# EasyEDA Pro project ProPrj_picoballoon-tracker-v2_2025-12-21.epro, schematic Schematic3
Board Name: Board3; Create Date: 2025-09-18; Page Name: P1; Project Name: picoballoon-tracker-v2; Schematic Name: Schematic3; Update Date: 2025-09-19; Company: EasyEDA.com; Page Size: A4; Version: V1.0
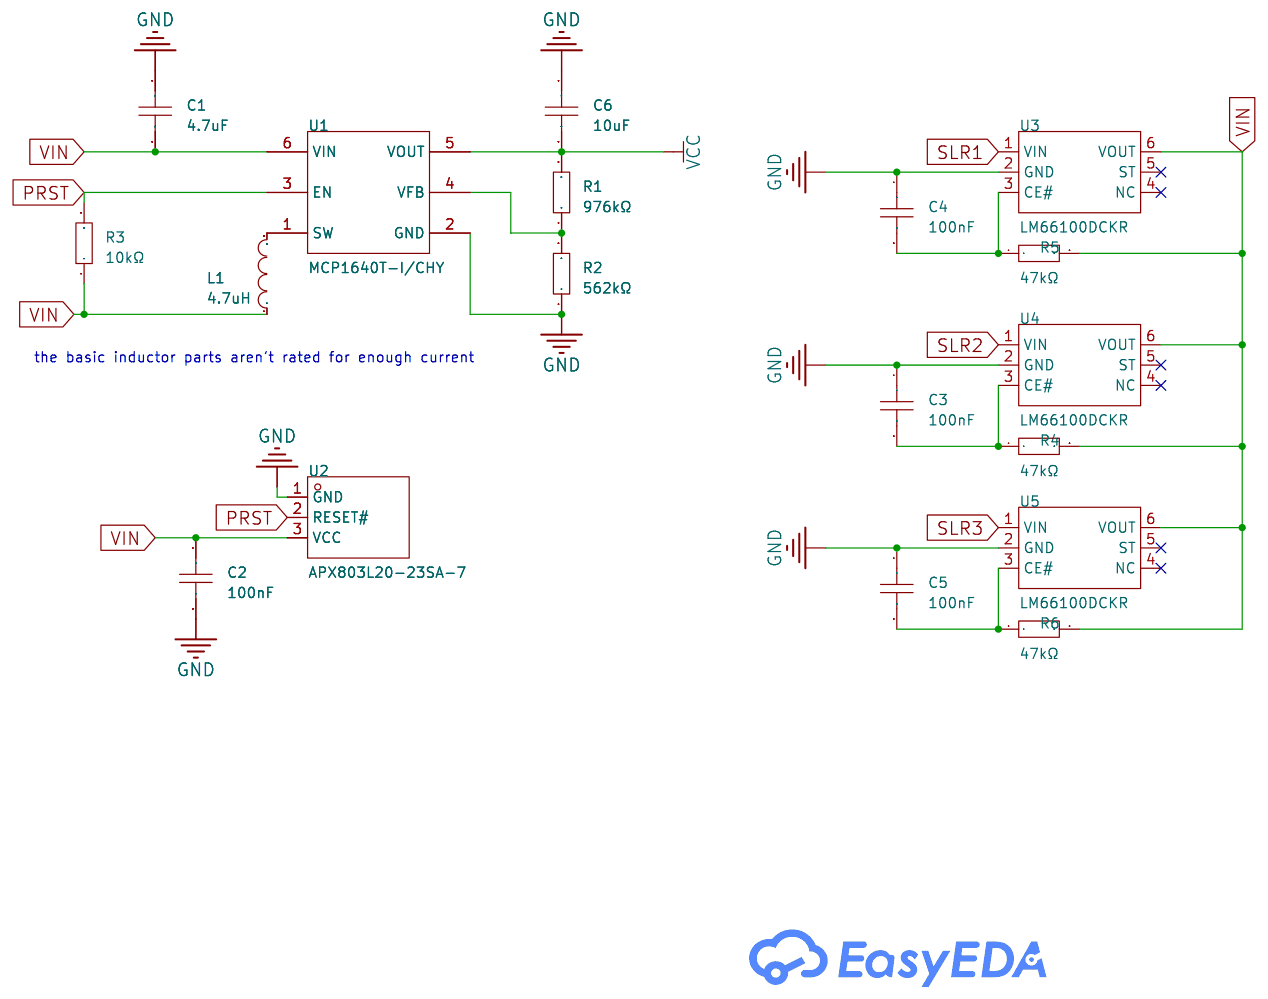
[diagram p2: schematic sheet]

## Parts
C1  4.7uF  [C0402]
C2  100nF  [C0402]
C3  100nF  [C0402]
C4  100nF  [C0402]
C5  100nF  [C0402]
C6  10uF  [C0402]
L1  4.7uH  [L0805]
R1  976kΩ  [R0402]
R2  562kΩ  [R0402]
R3  10kΩ  [R0402]
R4  47kΩ  [R0402]
R5  47kΩ  [R0402]
R6  47kΩ  [R0402]
U1  MCP1640T-I/CHY  [SOT-23-6_L2.9-W1.6-P0.95-LS2.8-BR]
U2  APX803L20-23SA-7  [SOT-23-3_L2.9-W1.3-P1.90-LS2.4-BR]
U3  LM66100DCKR  [SC-70-6_L2.0-W1.3-P0.65-LS2.1-BL]
U4  LM66100DCKR  [SC-70-6_L2.0-W1.3-P0.65-LS2.1-BL]
U5  LM66100DCKR  [SC-70-6_L2.0-W1.3-P0.65-LS2.1-BL]

## Library data of the parts
C1 = CL05A475MP5NRNC: Capacitance:4.7uF Tolerance:±20% Tolerance:±20% Voltage Rating:10V Temperature Coefficient:X5R; LCSC Part Name: 4.7uF ±20% 10V; Supplier Part: C23733; Manufacturer: SAMSUNG(三星); Supplier Footprint: 0402; JLCPCB Part Class: Basic Part; Datasheet: https://item.szlcsc.com/datasheet/CL05A475MP5NRNC/24469.html; Supplier: LCSC; Tolerance: ±20%; Voltage Rating: 10V; Temperature Coefficient: X5R
C2-C5 = CL05B104KO5NNNC: Capacitance:100nF Tolerance:±10% Tolerance:±10% Voltage Rating:16V Temperature Coefficient:X7R; LCSC Part Name: 100nF ±10% 16V; Supplier Part: C1525; Manufacturer: SAMSUNG(三星); Supplier Footprint: 0402; JLCPCB Part Class: Basic Part; Datasheet: https://item.szlcsc.com/datasheet/CL05B104KO5NNNC/1877.html; Supplier: LCSC; Tolerance: ±10%; Voltage Rating: 16V; Temperature Coefficient: X7R
C6 = CL05A106MQ5NUNC: Capacitance:10uF Tolerance:±20% Tolerance:±20% Voltage Rating:6.3V Temperature Coefficient:X5R; LCSC Part Name: 10uF ±20% 6.3V; Supplier Part: C15525; Manufacturer: SAMSUNG(三星); Supplier Footprint: 0402; JLCPCB Part Class: Basic Part; Datasheet: https://item.szlcsc.com/datasheet/CL05A106MQ5NUNC/16204.html; Supplier: LCSC; Tolerance: ±20%; Voltage Rating: 6.3V; Temperature Coefficient: X5R
L1 = LQM21PN4R7MGRD: Inductance: Tolerance:±20% Tolerance:±20% Rated Current: Saturation Current (Isat):- DC Resistance (DCR): Q @ Freq:- Frequency - Self Resonant: Ratings:; LCSC Part Name: 4.7uH ±20%; Supplier Part: C86090; Manufacturer: muRata(村田); Supplier Footprint: 0805; JLCPCB Part Class: Extended Part; Datasheet: https://atta.szlcsc.com/upload/public/pdf/source/20180326/C86090_F1DCF4677DBA65EF9113FC7328EBFD0F.pdf; Supplier: LCSC; Tolerance: ±20%
R1 = 0402WGF9763TCE: Type:Thick Film Resistor Resistance:976kΩ Tolerance:±1% Tolerance:±1% Power(Watts):62.5mW Voltage-Supply(Max):50V Temperature Coefficient:±100ppm/℃ Temperature Coefficient:±100ppm/℃ Operating Temperature:-55℃~+155℃ Operating Temperature:-55℃~+155℃; LCSC Part Name: 976kΩ ±1% 62.5mW 厚膜电阻; Supplier Part: C25802; Manufacturer: UNI-ROYAL(厚声); Supplier Footprint: 0402; JLCPCB Part Class: Extended Part; Datasheet: https://item.szlcsc.com/datasheet/0402WGF9763TCE/26545.html; Supplier: LCSC; Type: Thick Film Resistor; Tolerance: ±1%; Power(Watts): 62.5mW; Voltage-Supply(Max): 50V; Temperature Coefficient: ±100ppm/℃; Operating Temperature: -55℃~+155℃
R2 = RC0402FR-07562KL: Type:Thick Film Resistors Resistance: Tolerance:±1% Tolerance:±1% Power(Watts): Overload Voltage (Max): Temperature Coefficient:±100ppm/℃ Temperature Coefficient:±100ppm/℃ Operating Temperature Range:-55℃~+155℃ Operating Temperature Range:-55℃~+155℃; LCSC Part Name: 厚膜电阻 562kΩ ±1% 62.5mW; Supplier Part: C273337; Manufacturer: YAGEO(国巨); Supplier Footprint: 0402; JLCPCB Part Class: Extended Part; Datasheet: https://atta.szlcsc.com/upload/public/pdf/source/20180821/C275644_0D56F95EFF785E7D9A1FEF436B37DA78.pdf; Supplier: LCSC; Type: Thick Film Resistors; Tolerance: ±1%; Temperature Coefficient: ±100ppm/℃; Operating Temperature Range: -55℃~+155℃
R3 = 0402WGF1002TCE: Type:Thick Film Resistor Resistance:10kΩ Tolerance:±1% Tolerance:±1% Power(Watts):62.5mW Voltage-Supply(Max):50V Temperature Coefficient:±100ppm/℃ Temperature Coefficient:±100ppm/℃ Operating Temperature:-55℃~+155℃ Operating Temperature:-55℃~+155℃; LCSC Part Name: 10kΩ ±1% 62.5mW 厚膜电阻; Supplier Part: C25744; Manufacturer: UNI-ROYAL(厚声); Supplier Footprint: 0402; JLCPCB Part Class: Basic Part; Datasheet: https://item.szlcsc.com/datasheet/0402WGF1002TCE/26487.html; Supplier: LCSC; Type: Thick Film Resistor; Tolerance: ±1%; Power(Watts): 62.5mW; Voltage-Supply(Max): 50V; Temperature Coefficient: ±100ppm/℃; Operating Temperature: -55℃~+155℃
R4-R6 = 0402WGF4702TCE: Type:Thick Film Resistor Resistance:47kΩ Tolerance:±1% Tolerance:±1% Power(Watts):62.5mW Voltage-Supply(Max):50V Temperature Coefficient:±100ppm/℃ Temperature Coefficient:±100ppm/℃ Operating Temperature:-55℃~+155℃ Operating Temperature:-55℃~+155℃; LCSC Part Name: 47kΩ ±1% 62.5mW 厚膜电阻; Supplier Part: C25792; Manufacturer: UNI-ROYAL(厚声); Supplier Footprint: 0402; JLCPCB Part Class: Basic Part; Datasheet: https://item.szlcsc.com/datasheet/0402WGF4702TCE/26535.html; Supplier: LCSC; Type: Thick Film Resistor; Tolerance: ±1%; Power(Watts): 62.5mW; Voltage-Supply(Max): 50V; Temperature Coefficient: ±100ppm/℃; Operating Temperature: -55℃~+155℃
U1 = MCP1640T-I/CHY: Function:Boost type Output Type:Adjustable Input Voltage:- Input Voltage:- Output Voltage:2V~5.5V Output Voltage:2V~5.5V Output Current:350mA Switching Frequency:- Switching Frequency:- Operating Temperature:-40℃~+125℃ Operating Temperature:-40℃~+125℃ Syn; LCSC Part Name: 同步升压调节器; Supplier Part: C44365; Manufacturer: MICROCHIP(美国微芯); Supplier Footprint: SOT-23-6; JLCPCB Part Class: Extended Part; Datasheet: https://atta.szlcsc.com/upload/public/pdf/source/20150319/1457707270677.pdf; Supplier: LCSC; Function: Boost type; Output Type: Adjustable; Output Voltage: 2V~5.5V; Output Current: 350mA; Operating Temperature: -40℃~+125℃; Number of Outputs: 1; Topology: Boost; Quiescent Current (Iq): 19uA; Switch tube (built-in/external): Built-in
U2 = APX803L20-23SA-7: ChipType:Voltage Detector Output Type:Open Drain Voltage - Supply:900mV~5.5V Voltage - Supply:900mV~5.5V Reset Active Level:Active Low Threshold Voltage:2.3V Number of Voltages Monitored:1 Manual Reset:No Watchdog:No Reset Timeout:220ms Operating Temperat; Supplier Part: C2067783; Manufacturer: DIODES(美台); Supplier Footprint: SOT-23; JLCPCB Part Class: Extended Part; Datasheet: https://atta.szlcsc.com/upload/public/pdf/source/20191127/C460557_9D36FAD027939854CDD621D25A26370F.pdf; Supplier: LCSC; ChipType: Voltage Detector; Output Type: Open Drain; Voltage - Supply: 900mV~5.5V; Reset Active Level: Active Low; Threshold Voltage: 2.3V; Number of Voltages Monitored: 1; Manual Reset: No; Watchdog: No; Reset Timeout: 220ms; Operating Temperature: -40℃~+85℃@(TA)
U3-U5 = LM66100DCKR_C2869734: LCSC Part Name: 5.5V 1.5A 低静态电流理想二极管; Supplier Part: C2869734; Manufacturer: TI(德州仪器); Supplier Footprint: SC-70-6; JLCPCB Part Class: Extended Part; Datasheet: https://www.ti.com/cn/lit/gpn/lm66100; Supplier: LCSC

## Nets
GND: C1.1 C2.2 C3.1 C4.1 C5.1 C6.1 R2.1 U1.2(GND) U2.1(GND) U3.2(GND) U4.2(GND) U5.2(GND)
VCC: C6.2 R1.2 U1.5(VOUT)
VIN: C1.2 C2.1 L1.1 R3.1 R4.2 R5.2 R6.2 U1.6(VIN) U2.3(VCC) U3.6(VOUT) U4.6(VOUT) U5.6(VOUT)
PRST: R3.2 U1.3(EN) U2.2(RESET#)
SLR1: U3.1(VIN)
SLR2: U4.1(VIN)
SLR3: U5.1(VIN)
$1N416: R1.1 R2.2 U1.4(VFB)
$1N419: L1.2 U1.1(SW)
$1N912: C4.2 R5.1 U3.3(CE#)
$1N938: C3.2 R4.1 U4.3(CE#)
$1N951: C5.2 R6.1 U5.3(CE#)

Not connected (* = marked no-connect by the designer): U3 4(NC)* 5(ST)*; U4 4(NC)* 5(ST)*; U5 4(NC)* 5(ST)*

## Notes on the sheet
- the basic inductor parts aren't rated for enough current
